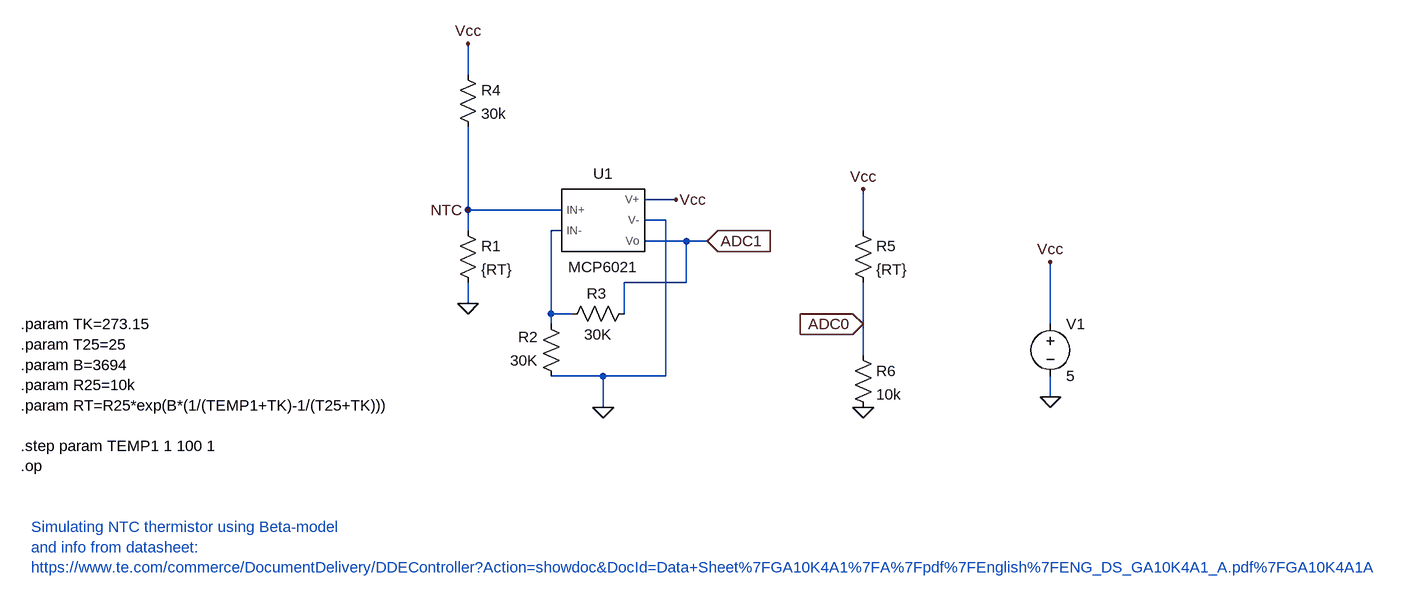
[diagram p0: schematic NTC_with_MCP6021_OpAmp.asc]
NTC_with_MCP6021_OpAmp.asc, the LTspice schematic file:
Version 4
SHEET 1 3548 1060
WIRE 160 -16 160 -64
WIRE 480 176 432 176
WIRE 160 192 160 64
WIRE 304 192 160 192
WIRE 464 208 432 208
WIRE 160 224 160 192
WIRE 304 224 288 224
WIRE 768 224 768 160
WIRE 496 240 432 240
WIRE 528 240 496 240
WIRE 496 304 496 240
WIRE 496 304 400 304
WIRE 160 336 160 304
WIRE 288 352 288 224
WIRE 320 352 288 352
WIRE 400 352 400 304
WIRE 288 368 288 352
WIRE 768 368 768 304
WIRE 1056 368 1056 272
WIRE 768 416 768 368
WIRE 368 448 288 448
WIRE 464 448 464 208
WIRE 464 448 368 448
WIRE 1056 480 1056 448
WIRE 368 496 368 448
FLAG 1056 480 0
FLAG 1056 272 Vcc
FLAG 160 -64 Vcc
FLAG 160 336 0
FLAG 480 176 Vcc
FLAG 368 496 0
FLAG 768 496 0
FLAG 768 160 Vcc
FLAG 528 240 ADC1
IOPIN 528 240 In
FLAG 160 192 NTC
FLAG 768 368 ADC0
IOPIN 768 368 In
SYMBOL res 304 464 R180
WINDOW 0 36 76 Left 2
WINDOW 3 36 40 Left 2
SYMATTR InstName R2
SYMATTR Value 30K
SYMBOL res 304 368 R270
WINDOW 0 32 54 VTop 2
WINDOW 3 0 56 VBottom 2
SYMATTR InstName R3
SYMATTR Value 30K
SYMBOL voltage 1056 352 R0
WINDOW 123 0 0 Left 0
WINDOW 39 0 0 Left 0
SYMATTR InstName V1
SYMATTR Value 5
SYMBOL res 144 -32 R0
SYMATTR InstName R4
SYMATTR Value 30k
SYMBOL res 144 208 R0
SYMATTR InstName R1
SYMATTR Value {RT}
SYMATTR SpiceLine tol=1
SYMBOL AutoGenerated\\MCP6021 368 208 R0
SYMATTR InstName U1
SYMBOL res 752 208 R0
SYMATTR InstName R5
SYMATTR Value {RT}
SYMBOL res 752 400 R0
SYMATTR InstName R6
SYMATTR Value 10k
TEXT -512 680 Left 2 ;Simulating NTC thermistor using Beta-model\nand info from datasheet:\nhttps://www.te.com/commerce/DocumentDelivery/DDEController?Action=showdoc&DocId=Data+Sheet%7FGA10K4A1%7FA%7Fpdf%7FEnglish%7FENG_DS_GA10K4A1_A.pdf%7FGA10K4A1A
TEXT -528 368 Left 2 !.param TK=273.15\n.param T25=25\n.param B=3694\n.param R25=10k\n.param RT=R25*exp(B*(1/(TEMP1+TK)-1/(T25+TK)))\n \n.step param TEMP1 1 100 1\n.op

The netlist it stands for:
* NTC_with_MCP6021_OpAmp.asc
R2 0 N001 30K
R3 N001 ADC1 30K
V1 Vcc 0 5
R4 Vcc NTC 30k
R1 NTC 0 {RT} tol=1
XU1 NTC N001 Vcc 0 ADC1 MCP6021  ; pins IN+ IN- V+ V- Vo
R5 Vcc ADC0 {RT}
R6 ADC0 0 10k
* Simulating NTC thermistor using Beta-model
* and info from datasheet:
* https://www.te.com/commerce/DocumentDelivery/DDEController?Action=showdoc&DocId=Data+Sheet%7FGA10K4A1%7FA%7Fpdf%7FEnglish%7FENG_DS_GA10K4A1_A.pdf%7FGA10K4A1A
.param TK=273.15
.param T25=25
.param B=3694
.param R25=10k
.param RT=R25*exp(B*(1/(TEMP1+TK)-1/(T25+TK)))
.step param TEMP1 1 100 1
.op
.lib C:\Users\alfre\Desktop\HydrogelHeater\lt_spice_sims\3D_party_spice_models\opamp\MCP6021_MM_B\MCP6021.txt
.backanno
.end